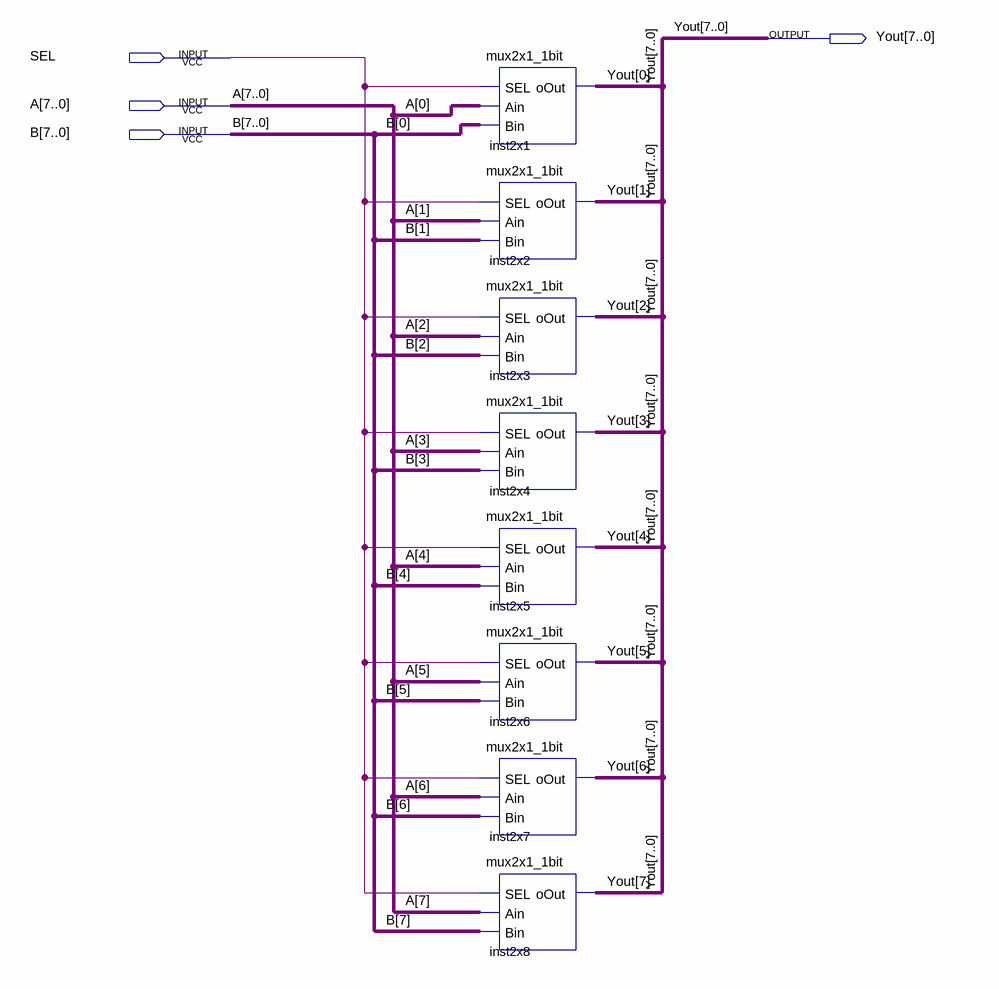
[diagram p0: schematic sheet]
// Quartus schematic mux2x1_8bit.bdf as structural Verilog: 8 symbols, 4 pins
module mux2x1_8bit (
  input  SEL,
  input  [7:0] A,
  input  [7:0] B,
  output [7:0] Yout
);

  mux2x1_1bit inst2x1 (.SEL(SEL), .Bin(B[0]), .Ain(A[0]), .oOut(Yout[0]));
  mux2x1_1bit inst2x2 (.SEL(SEL), .Bin(B[1]), .Ain(A[1]), .oOut(Yout[1]));
  mux2x1_1bit inst2x3 (.SEL(SEL), .Bin(B[2]), .Ain(A[2]), .oOut(Yout[2]));
  mux2x1_1bit inst2x4 (.SEL(SEL), .Bin(B[3]), .Ain(A[3]), .oOut(Yout[3]));
  mux2x1_1bit inst2x5 (.SEL(SEL), .Bin(B[4]), .Ain(A[4]), .oOut(Yout[4]));
  mux2x1_1bit inst2x6 (.SEL(SEL), .Bin(B[5]), .Ain(A[5]), .oOut(Yout[5]));
  mux2x1_1bit inst2x7 (.SEL(SEL), .Bin(B[6]), .Ain(A[6]), .oOut(Yout[6]));
  mux2x1_1bit inst2x8 (.SEL(SEL), .Bin(B[7]), .Ain(A[7]), .oOut(Yout[7]));
endmodule
